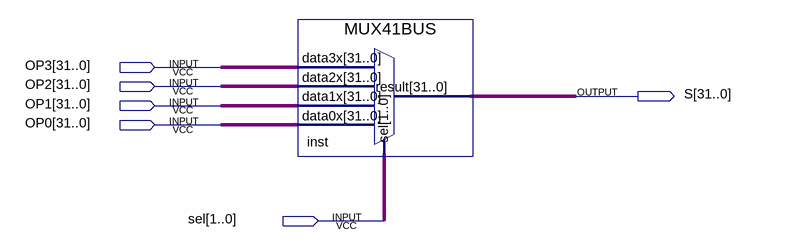
[diagram p0: schematic sheet]
// Quartus schematic testeMUXBUS.bdf as structural Verilog: 1 symbols, 6 pins
module testeMUXBUS (
  input  [31:0] OP3,
  input  [31:0] OP2,
  input  [31:0] OP1,
  input  [31:0] OP0,
  input  [1:0] sel,
  output [31:0] S
);

  MUX41BUS inst (.data3x(OP3), .data2x(OP2), .data1x(OP1), .data0x(OP0), .sel(sel), .result(S));
endmodule
